# Altium project PCB_Project_denilson.PrjPcb
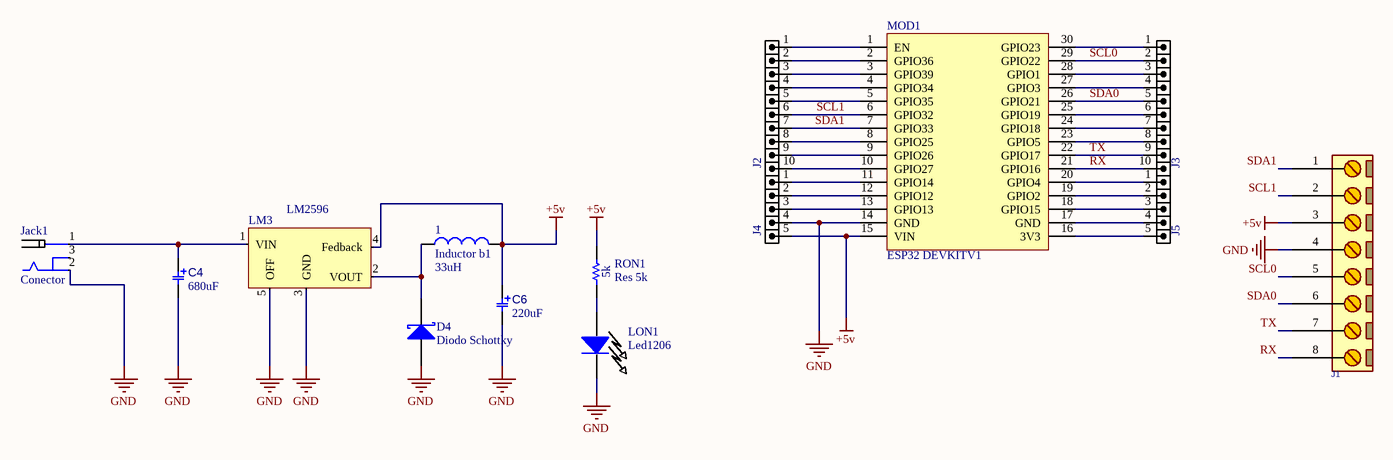
[diagram p0: Sheet1.SchDoc]
1 sheet, 14 parts. Net scope: global (net labels, ports and power ports of the same name join across sheets).
Board file: PCB1.PcbDoc

## Sheet Sheet1.SchDoc
size A4; SheetNumber: 1; SheetTotal: 1

### Parts
1  Inductor b1  value 33uH  [CYH74-33UH]
C4  Capacitance: 680uF  [CAP_EEEFK1E681SP]
C6  Capacitance: 220uF  [RVT220UF16V67RV0015]
D4  Diodo Schottky  [DO-214AC-2]
J1  CONN_TB8  [TBG_8]  (value not drawn)
J2  HDR1X10  [HDR_M_1X10]  (value not drawn)
J3  HDR1X10  [HDR_M_1X10]  (value not drawn)
J4  HDR1X5  [HDR_M_1X5]  (value not drawn)
J5  HDR1X5  [HDR_M_1X5]  (value not drawn)
Jack1  Conector  [Conector JACK]
LM3  LM2596  [LM2596]
LON1  Led1206  [LED1206]
MOD1  ESP32 DEVKITV1  [HDR_F_1X15]
RON1  Res 5k  [RES 0805 - 5k]

### Nets
+5v: 1.2 C6.1 J1.3 J4.5 LM3.4(Fedback) MOD1.15(VIN) RON1.2
GND: C4.2 C6.2 D4.2(A) J1.4 J4.4 Jack1.2(GND) LM3.3(GND) LM3.5(OFF) LON1.2(Càtodo) MOD1.14(GND)
RX: J1.8 J3.10 MOD1.21(GPIO16)
SCL0: J1.5 J3.2 MOD1.29(GPIO22)
SCL1: J1.2 J2.6 MOD1.6(GPIO32)
SDA0: J1.6 J3.5 MOD1.26(GPIO21)
SDA1: J1.1 J2.7 MOD1.7(GPIO33)
TX: J1.7 J3.9 MOD1.22(GPIO17)
Net1_1: 1.1 D4.1(K) LM3.2(VOUT)
NetC4_1: C4.1 Jack1.1(V+) LM3.1(VIN)
NetJ2_1: J2.1 MOD1.1(EN)
NetJ2_2: J2.2 MOD1.2(GPIO36)
NetJ2_3: J2.3 MOD1.3(GPIO39)
NetJ2_4: J2.4 MOD1.4(GPIO34)
NetJ2_5: J2.5 MOD1.5(GPIO35)
NetJ2_8: J2.8 MOD1.8(GPIO25)
NetJ2_9: J2.9 MOD1.9(GPIO26)
NetJ2_10: J2.10 MOD1.10(GPIO27)
NetJ3_1: J3.1 MOD1.30(GPIO23)
NetJ3_3: J3.3 MOD1.28(GPIO1)
NetJ3_4: J3.4 MOD1.27(GPIO3)
NetJ3_6: J3.6 MOD1.25(GPIO19)
NetJ3_7: J3.7 MOD1.24(GPIO18)
NetJ3_8: J3.8 MOD1.23(GPIO5)
NetJ4_1: J4.1 MOD1.11(GPIO14)
NetJ4_2: J4.2 MOD1.12(GPIO12)
NetJ4_3: J4.3 MOD1.13(GPIO13)
NetJ5_1: J5.1 MOD1.20(GPIO4)
NetJ5_2: J5.2 MOD1.19(GPIO2)
NetJ5_3: J5.3 MOD1.18(GPIO15)
NetJ5_4: J5.4 MOD1.17(GND)
NetJ5_5: J5.5 MOD1.16(3V3)
NetLON1_1: LON1.1(Ànodo) RON1.1

Not connected (* = marked no-connect by the designer): Jack1 3

### Notes on the sheet
- (in symbol Res 5k) 5k

### Library data of the parts
1 = Inductor: Code_IEC: 1005; Published: 8-Jun-2000; LatestRevisionDate: 29-May-2009; LatestRevisionNote: IPC-7351 Footprint Added.; PackageReference: 0402-A; Publisher: Altium Limited; PackageDescription: Chip Inductor; Code_JEITA: 0402
C4 C6 = CAP_SMD_EL_330u25V: Capacitor;  Alum Electrolytic;  Cap 330 uF;  Tol 20%;  Vol-Rtg 25 VDC;  SMT;  8x10.5;  CT; Manufacturer: Panasonic; Manufacturer Part Number: EEE-1EA331UP; Ripple Current: 270mA; Life (Hours): 2000Hour; Voltage Rating: 25V; Leakage Current: 3uA; Supplier 1: Arrow Electronics; RoHS: Yes; Category: Aluminum Electrolytic Capacitors; Stock 1: 7000; Pricing 1: 500=0.19230, 1000=0.14820, 2500=0.14670, 10000=0.14520, 25000=0.14380, 50000=0.14230 (USD); Mount: Surface Mount,PCB; Case/Package: Radial; Contact Plating: Tin; Min Operating Temperature: -40°C; Max Operating Temperature: 85°C; Tolerance: 20%; Termination: SMD/SMT; Packaging: Tape and Reel; Package Quantity: 1; Voltage Rating (DC): 25V; Voltage: 25V; Ripple Current (AC): 270mA; Diameter: 8mm; Length: 10.5mm; Height: 10.2mm; Height - Seated (Max): 0.402inch; Radiation Hardening: No; Lead Free: Lead Free; REACH SVHC: No SVHC; ComponentLink1URL: https://datasheet.ciiva.com/24070/aba0000ce2-40801-24070005.pdf?src-supplier=Mouser; ComponentLink1Description: https://datasheet.ciiva.com/24070/aba0000ce2-40801-24070005.pdf?src-supplier=Mouser; ComponentLink2URL: https://datasheet.ciiva.com/46378/aba0000ce2-46378294.pdf?src-supplier=Element14; ComponentLink2Description: https://datasheet.ciiva.com/46378/aba0000ce2-46378294.pdf?src-supplier=Element14; ComponentLink3URL: https://datasheet.ciiva.com/30071/11aba0000ce2-30071959.pdf?src-supplier=Onlinecomponents.com; ComponentLink3Description: https://datasheet.ciiva.com/30071/11aba0000ce2-30071959.pdf?src-supplier=Onlinecomponents.com; ComponentLink4URL: https://datasheet.ciiva.com/31414/aba0000ce2-31414664.pdf?src-supplier=Farnell; ComponentLink4Description: https://datasheet.ciiva.com/31414/aba0000ce2-31414664.pdf?src-supplier=Farnell; ComponentLink5URL: https://datasheet.ciiva.com/46374/aba0000ce2-46374392.pdf?src-supplier=Element14; ComponentLink5Description: https://datasheet.ciiva.com/46374/aba0000ce2-46374392.pdf?src-supplier=Element14; ComponentLink6URL: https://datasheet.ciiva.com/16397/aba0000ce2-16397068.pdf?src-supplier=Future+Electronics; ComponentLink6Description: https://datasheet.ciiva.com/16397/aba0000ce2-16397068.pdf?src-supplier=Future+Electronics; ComponentLink7URL: https://datasheet.ciiva.com/17535/aba0000ce2-17535308.pdf?src-supplier=Avnet+Europe; ComponentLink7Description: https://datasheet.ciiva.com/17535/aba0000ce2-17535308.pdf?src-supplier=Avnet+Europe; ComponentLink8URL: https://datasheet.ciiva.com/2985/aba0000ce2-2985133.pdf?src-supplier=Avnet; ComponentLink8Description: https://datasheet.ciiva.com/2985/aba0000ce2-2985133.pdf?src-supplier=Avnet; ComponentLink9URL: https://datasheet.ciiva.com/14610/70255710-14610287.pdf?src-supplier=Allied+Electronics; ComponentLink9Description: https://datasheet.ciiva.com/14610/70255710-14610287.pdf?src-supplier=Allied+Electronics; Supplier Part Number 1: EEE-1EA331UP
J1 = Bloque Terminal 8: CONN, TERMINAL BLOCK, 5.08mm pitch; VALUE: CONN_TB8
J2 J3 = Header Male THT 1x10: CONN, HEADER, Male, pitch: 2.54mm, 10POS; Huella: ?; Link_Supplier: ?; Manufacturer: ?; Manufacturer Part: ?; Price: ?; Supplier: ?; Supplier Part: ?; Value: ?
J4 J5 = Header Male THT 1x5: CONN, HEADER, Male, pitch: 2.54mm, 5POS; Huella: ?; Link_Supplier: ?; Manufacturer: ?; Manufacturer Part: ?; Price: ?; Supplier: ?; Supplier Part: ?; Value: ?
LON1 = Led1206: NCD1206R1
RON1 = Res 5k: ARG05DTC5001